# Altium project TMC5160_BOB_V1_2.PrjPcb
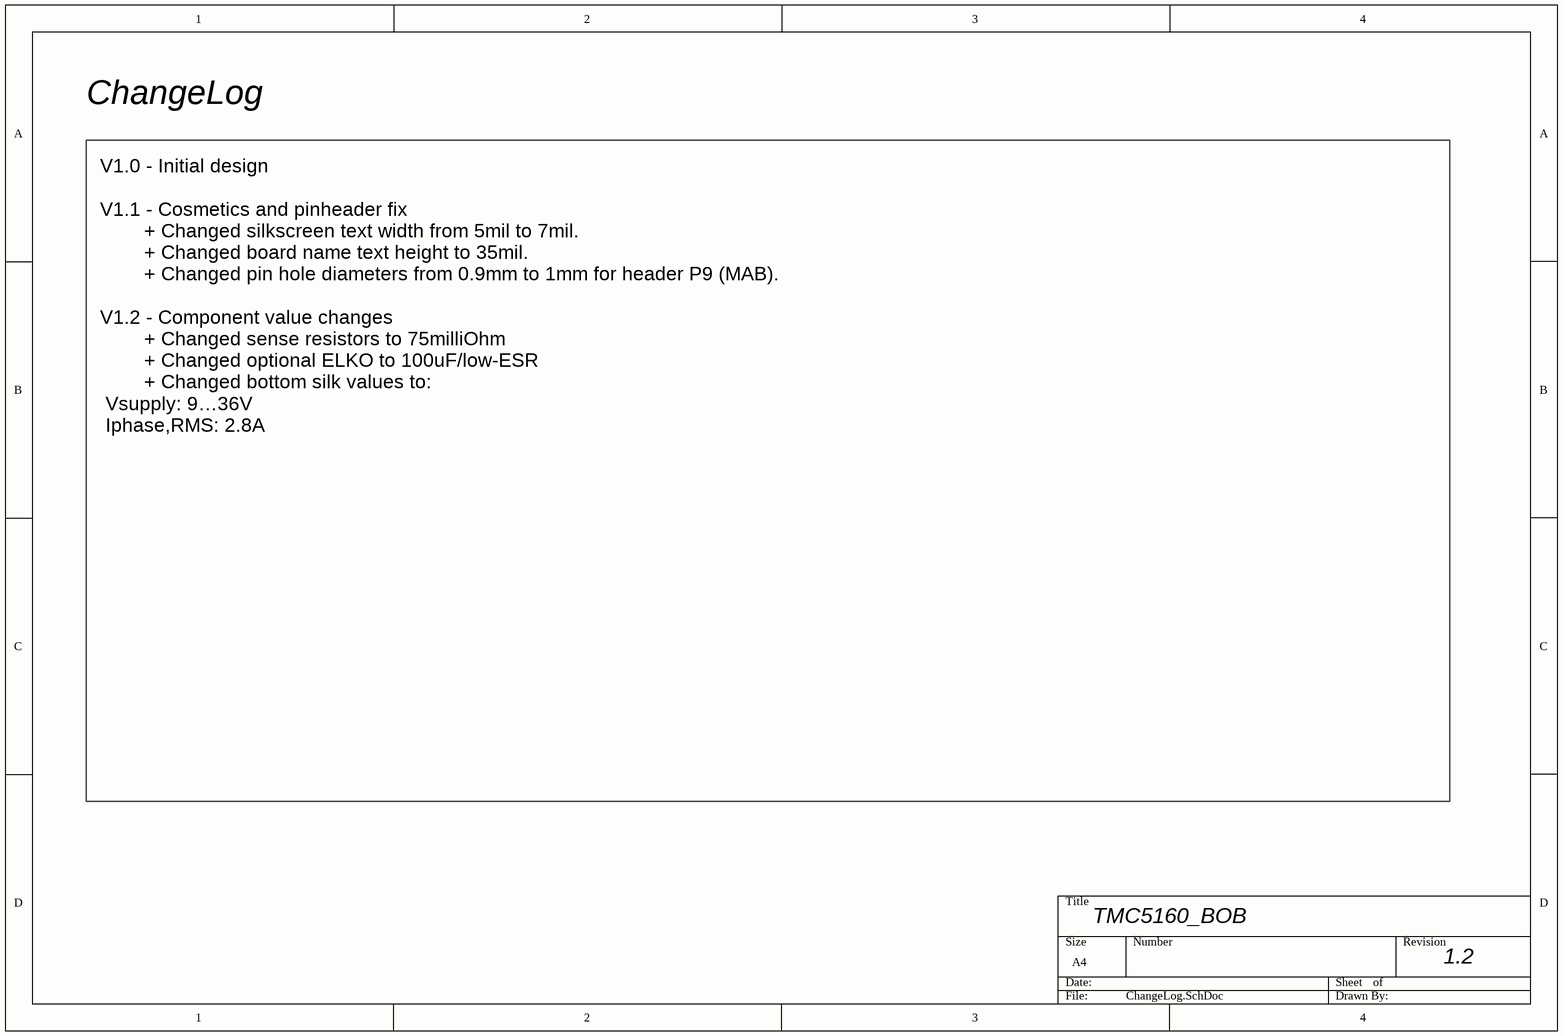
[diagram p0: ChangeLog.SchDoc]
BoardName: TMC5160_BOB; BoardVersion: 1.2
2 sheets, 49 parts. Net scope: global (net labels, ports and power ports of the same name join across sheets).
Board file: TMC5160_BOB_V1_2.PcbDoc
Sheets:
  ChangeLog.SchDoc
  TMC5160_BOB_V1_2.SchDoc

## Sheet ChangeLog.SchDoc
size A4

### Notes on the sheet
- ChangeLog
- V1.0 - Initial design
  V1.1 - Cosmetics and pinheader fix
  + Changed silkscreen text width from 5mil to 7mil.
  + Changed board name text height to 35mil.
  + Changed pin hole diameters from 0.9mm to 1mm for header P9 (MAB).
  V1.2 - Component value changes
  + Changed sense resistors to 75milliOhm
  + Changed optional ELKO to 100uF/low-ESR
  + Changed bottom silk values to:
  Vsupply: 9…36V
  Iphase,RMS: 2.8A

## Sheet TMC5160_BOB_V1_2.SchDoc: TMC5160 BOB V1.2
size 330 x 219 mm; Date: 11/5/2024; Organization: Mastermind Electronics; Revision: 1.2; SheetNumber: 1; SheetTotal: 1
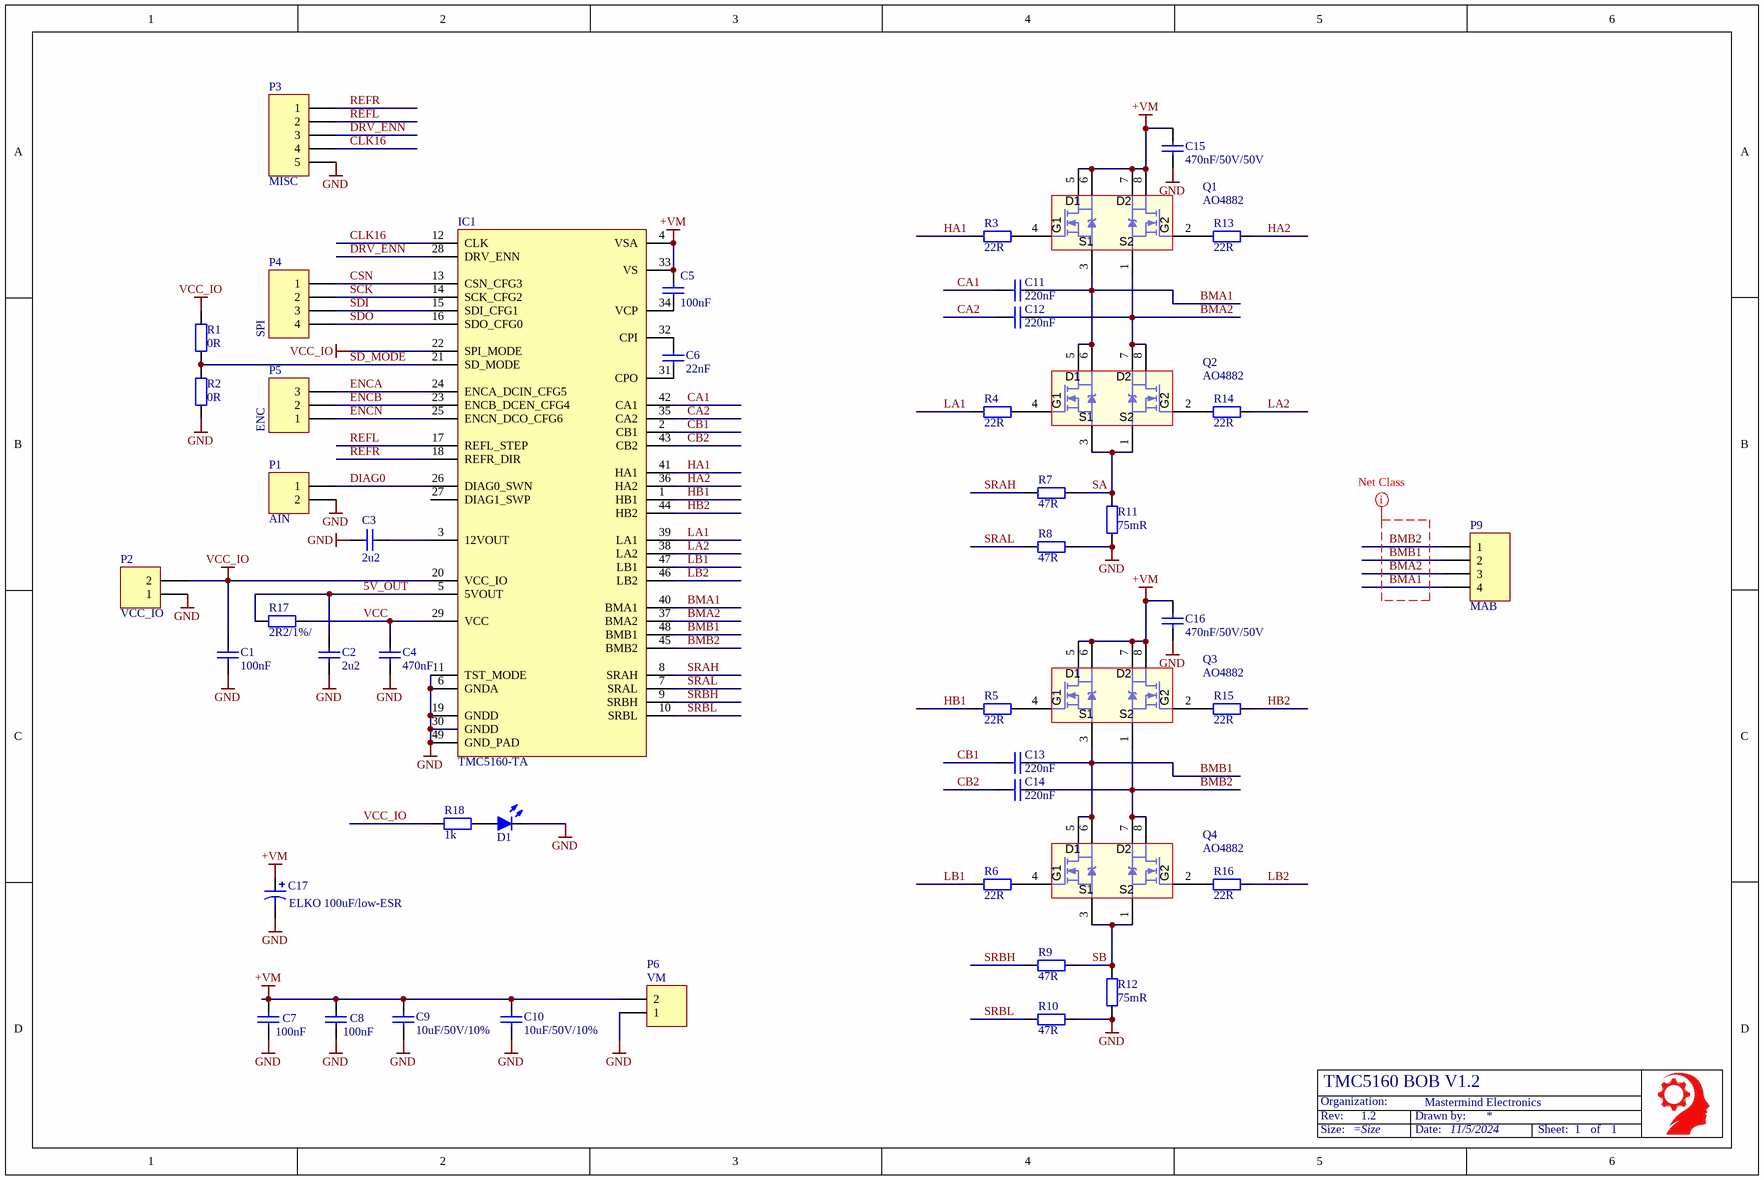
[diagram p1: TMC5160_BOB_V1_2.SchDoc]

### Parts
*  TitleBlock  (value not drawn)  (graphical)
C1  100nF  [C0603]
C2  2u2  [C0603]
C3  2u2  [C0603]
C4  470nF  [C0603]
C5  100nF  [C0603]
C6  22nF  [C0603]
C7  100nF  [C0603]
C8  100nF  [C0603]
C9  10uF/50V/10%  [C1206]
C10  10uF/50V/10%  [C1206]
C11  220nF  [C0603]
C12  220nF  [C0603]
C13  220nF  [C0603]
C14  220nF  [C0603]
C15  470nF/50V/50V  [C0603]
C16  470nF/50V/50V  [C0603]
C17  value ELKO 100uF/low-ESR  [EXT_POL_CAP]  (hidden comment: Cap Pol1)
D1  LED, Blue, SMD, 20mA, 2.8V, 465 nm  [LED_0603]  (value not drawn)
IC1  TMC5160-TA  [TMC5160_TSQFP50P900X900X120_HS-49L]
P1  AIN  [2_PIN_THT]
P2  VCC_IO  [2_PIN_THT]
P3  MISC  [5_PIN_THT]
P4  SPI  [4_PIN_THT]
P5  ENC  [3_PIN_THT]
P6  VM  [2_PIN_THT]
P9  MAB  [4_PIN_THT_1mm_hole]
Q1  AO4882  [SOP127P600X170-8L]
Q2  AO4882  [SOP127P600X170-8L]
Q3  AO4882  [SOP127P600X170-8L]
Q4  AO4882  [SOP127P600X170-8L]
R1  0R  [R0603]
R2  0R  [R0603]
R3  Resistance: 22R  [R0603]  (hidden comment: 22R / 100mW / 1%)
R4  Resistance: 22R  [R0603]  (hidden comment: 22R / 100mW / 1%)
R5  Resistance: 22R  [R0603]  (hidden comment: 22R / 100mW / 1%)
R6  Resistance: 22R  [R0603]  (hidden comment: 22R / 100mW / 1%)
R7  Resistance: 47R  [R0603]  (hidden comment: 47R /  / 1%)
R8  Resistance: 47R  [R0603]  (hidden comment: 47R /  / 1%)
R9  Resistance: 47R  [R0603]  (hidden comment: 47R /  / 1%)
R10  Resistance: 47R  [R0603]  (hidden comment: 47R /  / 1%)
R11  75mR  [R1206]
R12  75mR  [R1206]
R13  Resistance: 22R  [R0603]  (hidden comment: 22R / 100mW / 1%)
R14  Resistance: 22R  [R0603]  (hidden comment: 22R / 100mW / 1%)
R15  Resistance: 22R  [R0603]  (hidden comment: 22R / 100mW / 1%)
R16  Resistance: 22R  [R0603]  (hidden comment: 22R / 100mW / 1%)
R17  2R2/1%/  [R0603]
R18  1k  [R0603]

### Nets
+VM: C5.1 C7.1 C8.1 C9.2 C10.2 C15.1 C16.1 C17.1 IC1.4(VSA) IC1.33(VS) P6.2 Q1.5(D1) Q1.6(D1) Q1.7(D2) Q1.8(D2) Q3.5(D1) Q3.6(D1) Q3.7(D2) Q3.8(D2)
GND: C1.2 C2.2 C3.1 C4.2 C7.2 C8.2 C9.1 C10.1 C15.2 C16.2 C17.2 D1.2(K) IC1.6(GNDA) IC1.11(TST_MODE) IC1.19(GNDD) IC1.30(GNDD) IC1.49(GND_PAD) P1.2 P2.1 P3.5 P6.1 R2.2 R8.1 R10.1 R11.2 R12.2
VCC_IO: C1.1 IC1.20(VCC_IO) IC1.22(SPI_MODE) P2.2 R1.1 R18.1
5V_OUT: C2.1 IC1.5(5VOUT) R17.1
BMA1: C11.2 IC1.40(BMA1) P9.4 Q1.3(S1) Q2.5(D1) Q2.6(D1)
BMA2: C12.2 IC1.37(BMA2) P9.3 Q1.1(S2) Q2.7(D2) Q2.8(D2)
BMB1: C13.2 IC1.48(BMB1) P9.2 Q3.3(S1) Q4.5(D1) Q4.6(D1)
BMB2: C14.2 IC1.45(BMB2) P9.1 Q3.1(S2) Q4.7(D2) Q4.8(D2)
CA1: C11.1 IC1.42(CA1)
CA2: C12.1 IC1.35(CA2)
CB1: C13.1 IC1.2(CB1)
CB2: C14.1 IC1.43(CB2)
CLK16: IC1.12(CLK) P3.4
CSN: IC1.13(CSN_CFG3) P4.1
DIAG0: IC1.26(DIAG0_SWN) P1.1
DRV_ENN: IC1.28(DRV_ENN) P3.3
ENCA: IC1.24(ENCA_DCIN_CFG5) P5.3
ENCB: IC1.23(ENCB_DCEN_CFG4) P5.2
ENCN: IC1.25(ENCN_DCO_CFG6) P5.1
HA1: IC1.41(HA1) R3.2
HA2: IC1.36(HA2) R13.1
HB1: IC1.1(HB1) R5.2
HB2: IC1.44(HB2) R15.1
LA1: IC1.39(LA1) R4.2
LA2: IC1.38(LA2) R14.1
LB1: IC1.47(LB1) R6.2
LB2: IC1.46(LB2) R16.1
REFL: IC1.17(REFL_STEP) P3.2
REFR: IC1.18(REFR_DIR) P3.1
SA: Q2.1(S2) Q2.3(S1) R7.1 R11.1
SB: Q4.1(S2) Q4.3(S1) R9.1 R12.1
SCK: IC1.14(SCK_CFG2) P4.2
SD_MODE: IC1.21(SD_MODE) R1.2 R2.1
SDI: IC1.15(SDI_CFG1) P4.3
SDO: IC1.16(SDO_CFG0) P4.4
SRAH: IC1.8(SRAH) R7.2
SRAL: IC1.7(SRAL) R8.2
SRBH: IC1.9(SRBH) R9.2
SRBL: IC1.10(SRBL) R10.2
VCC: C4.1 IC1.29(VCC) R17.2
NetC3_2: C3.2 IC1.3(12VOUT)
NetC5_2: C5.2 IC1.34(VCP)
NetC6_1: C6.1 IC1.31(CPO)
NetC6_2: C6.2 IC1.32(CPI)
NetD1_1: D1.1(A) R18.2
NetQ1_2: Q1.2(G2) R13.2
NetQ1_4: Q1.4(G1) R3.1
NetQ2_2: Q2.2(G2) R14.2
NetQ2_4: Q2.4(G1) R4.1
NetQ3_2: Q3.2(G2) R15.2
NetQ3_4: Q3.4(G1) R5.1
NetQ4_2: Q4.2(G2) R16.2
NetQ4_4: Q4.4(G1) R6.1

Not connected (* = marked no-connect by the designer): IC1 27(DIAG1_SWP)

### Layout directives
net class MotorPowerOut: BMA1, BMA2, BMB1, BMB2

### Notes on the sheet
- (in symbol TitleBlock) Organization:; Rev:; Drawn by:; Size:; Date:; Sheet:; of

### Library data of the parts
* = TitleBlock: Title Block for Schematic Sheets
C1 C7 C8 = Capacitor: Ceramic capacitor; Manufacturer: Multicomp; MPN: MC0603F104M500CT; Type: MLCC; Voltage rating: 50V; ComponentLinknDescription: Datasheet; Precision: 20%; Characteristic: *; ComponentLinknURL: *; Capacitance: 100nF
C2 C3 = 2.2 µF, 25 V, ± 10%, X5R, GRM Series: SMD Multilayer Ceramic Capacitor, 0603 [1608 Metric], 2.2 µF, 25 V, ± 10%, X5R, GRM Series; MPN: GRM188R61E225KA12D; Type: MLCC; Voltage rating: 50V; ComponentLinknDescription: Datasheet; MF: MURATA; Characteristic: *; ComponentLinknURL: *; Capacitance: 2u2; Precision: 10%
C4 = Capacitor: Ceramic capacitor; MPN: MC0603X474K160CT; Type: MLCC; Voltage rating: 16V; ComponentLinknDescription: Datasheet; MF: Multicomp; Precision: 10%; Characteristic: *; ComponentLinknURL: *; Capacitance: 470nF
C5 = Capacitor: Ceramic capacitor; MPN: MC0603F104M500CT; Type: MLCC; Voltage rating: 50V; ComponentLinknDescription: Datasheet; MF: Multicomp; Precision: 20%; Characteristic: *; ComponentLinknURL: *; Capacitance: 100nF
C6 = Capacitor: Ceramic capacitor; MPN: MC0603B223K500CT; Type: MLCC; Voltage rating: 50V; ComponentLinknDescription: Datasheet; MF: Multicomp; Precision: 20%; Characteristic: *; ComponentLinknURL: *; Capacitance: 22nF
C9 C10 = 10 µF, 50 V, ± 20%, X5R, GRM Series: SMD Multilayer Ceramic Capacitor, 1206 [3216 Metric], 10 µF, 50 V, ± 20%, X5R, GRM Series; MPN: GRM31CR61H106MA12L; Type: MLCC; VoltageRating: 50V; ComponentLinknDescription: Datasheet; MF: MURATA; Capacitance: 10uF; Precision: 10%; Characteristic: *; ComponentLinknURL: *
C11-C14 = 0.22 µF, 50 V, ± 10%, X7R: SMD Multilayer Ceramic Capacitor, 0603 [1608 Metric], 0.22 µF, 50 V, ± 10%, X7R, GCM Series; MPN: GCM188R71H224KA64D; Type: MLCC; Voltage rating: 50V; ComponentLinknDescription: Datasheet; MF: MURATA; Characteristic: *; ComponentLinknURL: *; Capacitance: 220nF; Precision: 10%
C15 = 0.47 µF, 50 V, ± 10%, X7R, C Series: SMD Multilayer Ceramic Capacitor, 0603 [1608 Metric], 0.47 µF, 50 V, ± 10%, X7R, C Series; MPN: C1608X7R1H474K080AC; Type: MLCC; VoltageRating: 50V; ComponentLinknDescription: Datasheet; MF: TDK; Characteristic: *; ComponentLinknURL: *; Capacitance: 470nF/50V; Precision: 10%
C16 = 0.47 µF, 50 V, ± 10%, X7R, C Series: SMD Multilayer Ceramic Capacitor, 0603 [1608 Metric], 0.47 µF, 50 V, ± 10%, X7R, C Series; MPN: C1608X7R1H474K080AC; Type: MLCC; ComponentLinknDescription: Datasheet; MF: TDK; VoltageRating: 50V; Characteristic: *; ComponentLinknURL: *; Capacitance: 470nF/50V; Precision: 10%
C17 = Cap Pol1: Polarized Capacitor (Radial); Published: 8-Jun-2000; LatestRevisionDate: 17-Jul-2002; LatestRevisionNote: Re-released for DXP Platform.; PackageReference: RB7.6-15; Publisher: Altium Limited; PackageDescription: Polarized Capacitor (Radial); 2 Leads
D1 = LED, Blue, SMD, 20mA, 2.8V, 465 nm: MPN: LTST-C191TBKT-5A; MF: Lite-On; Current rating: 20mA; Colour: Blue
IC1 = TMC5160-TA: Manufacturer: TRINAMIC; Geometry.Height: 1,2mm; Distributor#1: Digikey; Distributor#2: *; MPN: TMC5160-TA; MF: TRINAMIC
P1 P2 P6 = Header 2: Header, 2-Pin; Fitted: Not fitted; LatestRevisionDate: 17-Jul-2002; LatestRevisionNote: Re-released for DXP Platform.; Publisher: Altium Limited; ComponentClass: Pinheader
P3 = Header 5: Header, 5-Pin; Fitted: Not fitted; LatestRevisionDate: 17-Jul-2002; LatestRevisionNote: Re-released for DXP Platform.; Publisher: Altium Limited
P4 = Header 4: Header, 4-Pin; Fitted: Not fitted; LatestRevisionDate: 17-Jul-2002; LatestRevisionNote: Re-released for DXP Platform.; Publisher: Altium Limited; ComponentClass: Pinheader
P5 = Header 3: Header, 3-Pin; Fitted: Not fitted; LatestRevisionDate: 17-Jul-2002; LatestRevisionNote: Re-released for DXP Platform.; Publisher: Altium Limited
P9 = Wire-To-Board Connector, 2.5 mm, 4 Contacts, Header, EH Series, Through Hole, 1 Rows: MPN: B4B-EH-A; MF: JST (JAPAN SOLDERLESS TERMINALS); Fitted: Not fitted
Q1-Q4 = AO4882 MOSFET 2N-CH 40V 8A 8SOIC: Mosfet Array 2 N-Channel (Dual) 40V 8A 2W Surface Mount 8-SOIC; MF: Alpha & Omega Semiconductor Inc.; MPN: AO4882
R1 R2 = 0 ohm, 0603 [1608 Metric], 100 mW, MCWR Series: SMD Chip Resistor, Thick Film, 0 ohm, 0603 [1608 Metric], 100 mW, MCWR Series; MPN: MCWR06X000 PTL; Temp coefficient: *ppm; PowerRating: 100mW; MF: MULTICOMP; Manufacturer: *; ComponentLinknURL: *; Resistance: 0R
R3-R6 R13-R16 = 22 ohm, 50 V, 0603 [1608 Metric], 100 mW, ± 1%, MCWR Series: SMD Chip Resistor, Thick Film, 22 ohm, 50 V, 0603 [1608 Metric], 100 mW, ± 1%, MCWR Series; MPN: MCWR06X22R0FTLV; Temp coefficient: *ppm; MF: MULTICOMP; Precision: 1%; PowerRating: 100mW; Manufacturer: *; ComponentLinknURL: *
R7-R10 = 47 ohm, 75 V, 0603 [1608 Metric], 100 mW, ± 1%, MCSR 06 Series: SMD Chip Resistor, Ceramic, 47 ohm, 75 V, 0603 [1608 Metric], 100 mW, ± 1%, MCSR 06 Series; MPN: MCSR06X47R0FTL; Temp coefficient: *ppm; MF: MULTICOMP; Precision: 1%; Manufacturer: *; ComponentLinknURL: *
R11 R12 = R_SENS, 0.075 ohm, 1206, 1W, ± 1%, ERJ Series: SMD Chip Resistor, Thick Film, Current Sense Resistors - SMD 1W 0.075ohm 1%; MPN: ERJ-8BWFR075V; VoltageRating: 50V; Temp coefficient: *ppm; MF: Panasonic Electronic Components; Precision: 1%; PowerRating: 1W; Resistance: 75mR
R17 = Resistor: MPN: MC0063W060312R2; Precision: 1%; Voltage rating: *V; Temp coefficient: *ppm; Power rating: *mW; ComponentLinknDescription: Datasheet; Resistance: 2R2; MF: Multicomp; ComponentLinknURL: *
R18 = 1 kohm, 50 V, 0603 [1608 Metric], 63 mW, ± 1%, MC Series: MPN: MC0063W060311K; VoltageRating: 50V; Temp coefficient: *ppm; PowerRating: 63mW; MF: MULTICOMP; Precision: 1%; Manufacturer: *; ComponentLinknURL: *; Resistance: 1k

## Assembly variants
TMC5160_RevA: not fitted C17 R1